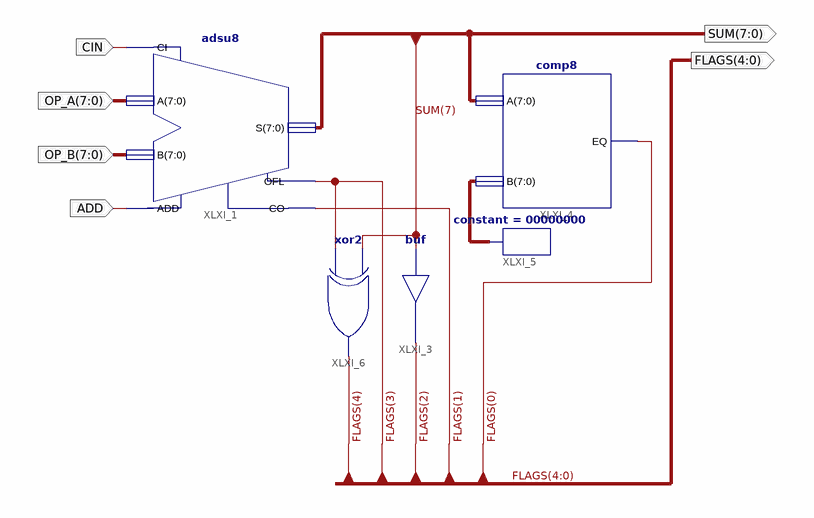
[diagram p0: schematic sheet 1]
// Xilinx ISE schematic adsu8_xilinx_draw.sch (virtex4) as structural Verilog: 5 symbols, 6 ports
module adsu8_xilinx_draw (
  input  [7:0] OP_A,
  input  [7:0] OP_B,
  input  ADD,
  input  CIN,
  output [7:0] SUM,
  output [4:0] FLAGS
);

  wire [7:0] XLXN_44;

  adsu8 XLXI_1 (.A(OP_A), .ADD(ADD), .B(OP_B), .CI(CIN), .CO(FLAGS[1]), .OFL(FLAGS[3]), .S(SUM));
  buf XLXI_3 (FLAGS[2], SUM[7]);
  comp8 XLXI_4 (.A(SUM), .B(XLXN_44), .EQ(FLAGS[0]));
  constant #(.CValue("00000000")) XLXI_5 (.O(XLXN_44));
  xor XLXI_6 (FLAGS[4], FLAGS[3], SUM[7]);
endmodule
